# EAGLE design Breadboard (EAGLE 9.4.2)

## Sheet 1 of 2
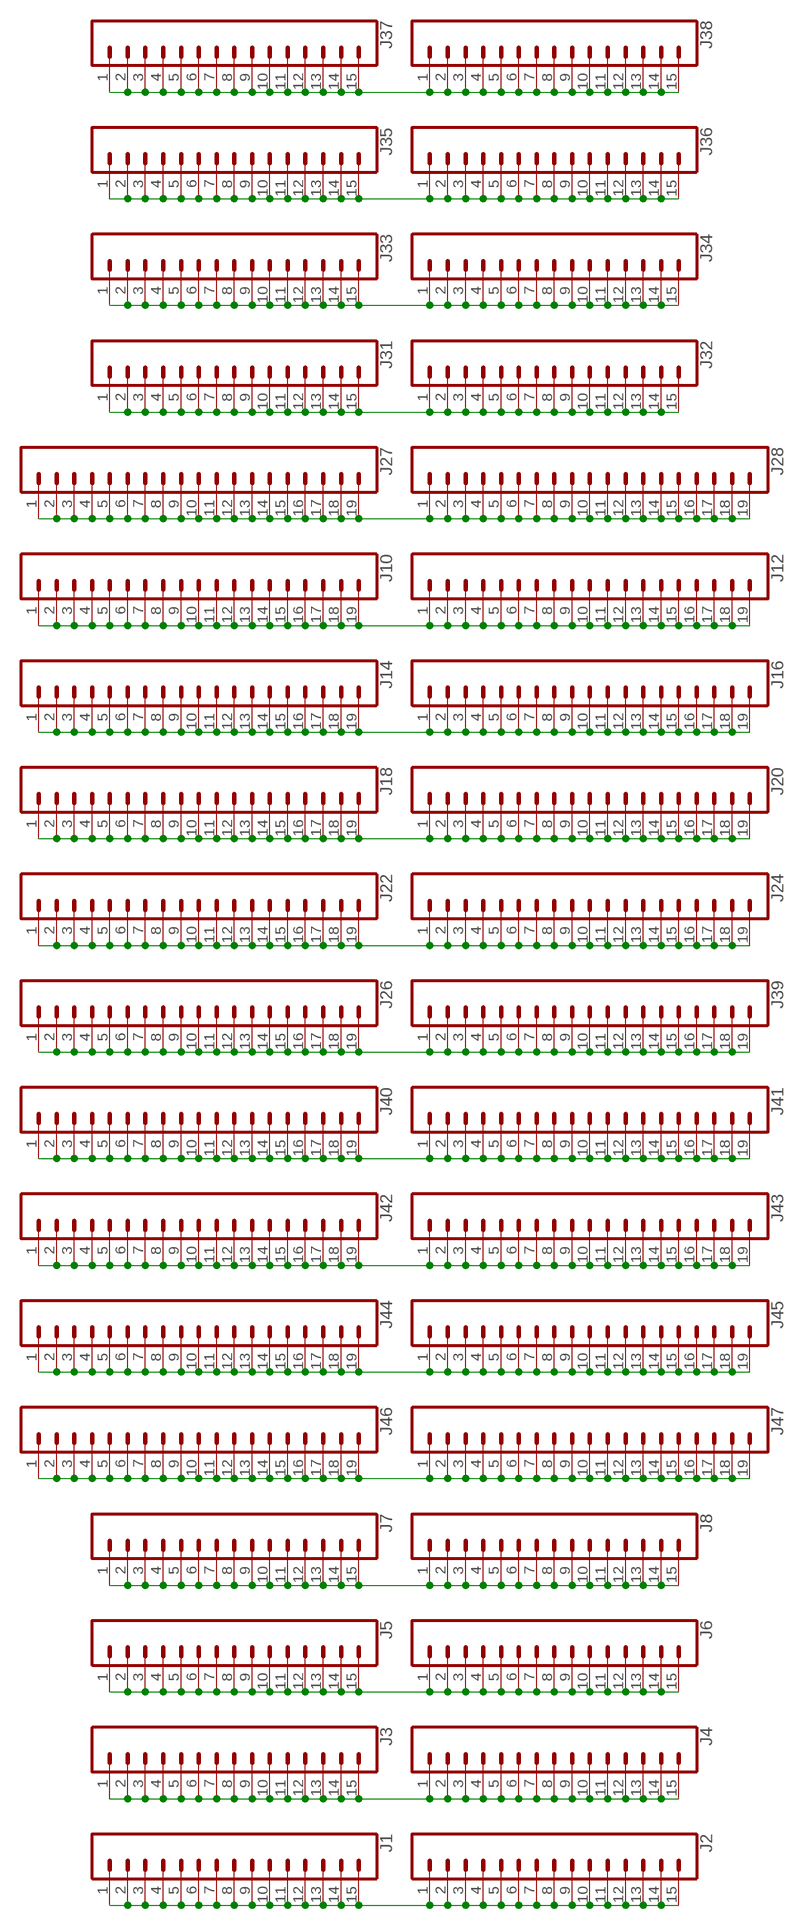
[diagram p0: schematic, sheet 1]

### Parts
J1  CONN_15  [1X15]
J2  CONN_15  [1X15]
J3  CONN_15  [1X15]
J4  CONN_15  [1X15]
J5  CONN_15  [1X15]
J6  CONN_15  [1X15]
J7  CONN_15  [1X15]
J8  CONN_15  [1X15]
J10  CONN_19  [1X19]
J12  CONN_19  [1X19]
J14  CONN_19  [1X19]
J16  CONN_19  [1X19]
J18  CONN_19  [1X19]
J20  CONN_19  [1X19]
J22  CONN_19  [1X19]
J24  CONN_19  [1X19]
J26  CONN_19  [1X19]
J27  CONN_19  [1X19]
J28  CONN_19  [1X19]
J31  CONN_15  [1X15]
J32  CONN_15  [1X15]
J33  CONN_15  [1X15]
J34  CONN_15  [1X15]
J35  CONN_15  [1X15]
J36  CONN_15  [1X15]
J37  CONN_15  [1X15]
J38  CONN_15  [1X15]
J39  CONN_19  [1X19]
J40  CONN_19  [1X19]
J41  CONN_19  [1X19]
J42  CONN_19  [1X19]
J43  CONN_19  [1X19]
J44  CONN_19  [1X19]
J45  CONN_19  [1X19]
J46  CONN_19  [1X19]
J47  CONN_19  [1X19]

### Nets
N$1: J37.1 J37.2 J37.3 J37.4 J37.5 J37.6 J37.7 J37.8 J37.9 J37.10 J37.11 J37.12 J37.13 J37.14 J37.15 J38.1 J38.2 J38.3 J38.4 J38.5 J38.6 J38.7 J38.8 J38.9 J38.10 J38.11 J38.12 J38.13 J38.14 J38.15
N$2: J35.1 J35.2 J35.3 J35.4 J35.5 J35.6 J35.7 J35.8 J35.9 J35.10 J35.11 J35.12 J35.13 J35.14 J35.15 J36.1 J36.2 J36.3 J36.4 J36.5 J36.6 J36.7 J36.8 J36.9 J36.10 J36.11 J36.12 J36.13 J36.14 J36.15
N$3: J33.1 J33.2 J33.3 J33.4 J33.5 J33.6 J33.7 J33.8 J33.9 J33.10 J33.11 J33.12 J33.13 J33.14 J33.15 J34.1 J34.2 J34.3 J34.4 J34.5 J34.6 J34.7 J34.8 J34.9 J34.10 J34.11 J34.12 J34.13 J34.14 J34.15
N$4: J31.1 J31.2 J31.3 J31.4 J31.5 J31.6 J31.7 J31.8 J31.9 J31.10 J31.11 J31.12 J31.13 J31.14 J31.15 J32.1 J32.2 J32.3 J32.4 J32.5 J32.6 J32.7 J32.8 J32.9 J32.10 J32.11 J32.12 J32.13 J32.14 J32.15
N$6: J27.1 J27.2 J27.3 J27.4 J27.5 J27.6 J27.7 J27.8 J27.9 J27.10 J27.11 J27.12 J27.13 J27.14 J27.15 J27.16 J27.17 J27.18 J27.19 J28.1 J28.2 J28.3 J28.4 J28.5 J28.6 J28.7 J28.8 J28.9 J28.10 J28.11 J28.12 J28.13 J28.14 J28.15 J28.16 J28.17 J28.18 J28.19
N$7: J10.1 J10.2 J10.3 J10.4 J10.5 J10.6 J10.7 J10.8 J10.9 J10.10 J10.11 J10.12 J10.13 J10.14 J10.15 J10.16 J10.17 J10.18 J10.19 J12.1 J12.2 J12.3 J12.4 J12.5 J12.6 J12.7 J12.8 J12.9 J12.10 J12.11 J12.12 J12.13 J12.14 J12.15 J12.16 J12.17 J12.18 J12.19
N$8: J14.1 J14.2 J14.3 J14.4 J14.5 J14.6 J14.7 J14.8 J14.9 J14.10 J14.11 J14.12 J14.13 J14.14 J14.15 J14.16 J14.17 J14.18 J14.19 J16.1 J16.2 J16.3 J16.4 J16.5 J16.6 J16.7 J16.8 J16.9 J16.10 J16.11 J16.12 J16.13 J16.14 J16.15 J16.16 J16.17 J16.18 J16.19
N$9: J18.1 J18.2 J18.3 J18.4 J18.5 J18.6 J18.7 J18.8 J18.9 J18.10 J18.11 J18.12 J18.13 J18.14 J18.15 J18.16 J18.17 J18.18 J18.19 J20.1 J20.2 J20.3 J20.4 J20.5 J20.6 J20.7 J20.8 J20.9 J20.10 J20.11 J20.12 J20.13 J20.14 J20.15 J20.16 J20.17 J20.18 J20.19
N$10: J22.1 J22.2 J22.3 J22.4 J22.5 J22.6 J22.7 J22.8 J22.9 J22.10 J22.11 J22.12 J22.13 J22.14 J22.15 J22.16 J22.17 J22.18 J22.19 J24.1 J24.2 J24.3 J24.4 J24.5 J24.6 J24.7 J24.8 J24.9 J24.10 J24.11 J24.12 J24.13 J24.14 J24.15 J24.16 J24.17 J24.18 J24.19
N$11: J26.1 J26.2 J26.3 J26.4 J26.5 J26.6 J26.7 J26.8 J26.9 J26.10 J26.11 J26.12 J26.13 J26.14 J26.15 J26.16 J26.17 J26.18 J26.19 J39.1 J39.2 J39.3 J39.4 J39.5 J39.6 J39.7 J39.8 J39.9 J39.10 J39.11 J39.12 J39.13 J39.14 J39.15 J39.16 J39.17 J39.18 J39.19
N$12: J40.1 J40.2 J40.3 J40.4 J40.5 J40.6 J40.7 J40.8 J40.9 J40.10 J40.11 J40.12 J40.13 J40.14 J40.15 J40.16 J40.17 J40.18 J40.19 J41.1 J41.2 J41.3 J41.4 J41.5 J41.6 J41.7 J41.8 J41.9 J41.10 J41.11 J41.12 J41.13 J41.14 J41.15 J41.16 J41.17 J41.18 J41.19
N$13: J42.1 J42.2 J42.3 J42.4 J42.5 J42.6 J42.7 J42.8 J42.9 J42.10 J42.11 J42.12 J42.13 J42.14 J42.15 J42.16 J42.17 J42.18 J42.19 J43.1 J43.2 J43.3 J43.4 J43.5 J43.6 J43.7 J43.8 J43.9 J43.10 J43.11 J43.12 J43.13 J43.14 J43.15 J43.16 J43.17 J43.18 J43.19
N$14: J44.1 J44.2 J44.3 J44.4 J44.5 J44.6 J44.7 J44.8 J44.9 J44.10 J44.11 J44.12 J44.13 J44.14 J44.15 J44.16 J44.17 J44.18 J44.19 J45.1 J45.2 J45.3 J45.4 J45.5 J45.6 J45.7 J45.8 J45.9 J45.10 J45.11 J45.12 J45.13 J45.14 J45.15 J45.16 J45.17 J45.18 J45.19
N$15: J46.1 J46.2 J46.3 J46.4 J46.5 J46.6 J46.7 J46.8 J46.9 J46.10 J46.11 J46.12 J46.13 J46.14 J46.15 J46.16 J46.17 J46.18 J46.19 J47.1 J47.2 J47.3 J47.4 J47.5 J47.6 J47.7 J47.8 J47.9 J47.10 J47.11 J47.12 J47.13 J47.14 J47.15 J47.16 J47.17 J47.18 J47.19
N$16: J7.1 J7.2 J7.3 J7.4 J7.5 J7.6 J7.7 J7.8 J7.9 J7.10 J7.11 J7.12 J7.13 J7.14 J7.15 J8.1 J8.2 J8.3 J8.4 J8.5 J8.6 J8.7 J8.8 J8.9 J8.10 J8.11 J8.12 J8.13 J8.14 J8.15
N$17: J5.1 J5.2 J5.3 J5.4 J5.5 J5.6 J5.7 J5.8 J5.9 J5.10 J5.11 J5.12 J5.13 J5.14 J5.15 J6.1 J6.2 J6.3 J6.4 J6.5 J6.6 J6.7 J6.8 J6.9 J6.10 J6.11 J6.12 J6.13 J6.14 J6.15
N$18: J3.1 J3.2 J3.3 J3.4 J3.5 J3.6 J3.7 J3.8 J3.9 J3.10 J3.11 J3.12 J3.13 J3.14 J3.15 J4.1 J4.2 J4.3 J4.4 J4.5 J4.6 J4.7 J4.8 J4.9 J4.10 J4.11 J4.12 J4.13 J4.14 J4.15
N$19: J1.1 J1.2 J1.3 J1.4 J1.5 J1.6 J1.7 J1.8 J1.9 J1.10 J1.11 J1.12 J1.13 J1.14 J1.15 J2.1 J2.2 J2.3 J2.4 J2.5 J2.6 J2.7 J2.8 J2.9 J2.10 J2.11 J2.12 J2.13 J2.14 J2.15

## Sheet 2 of 2
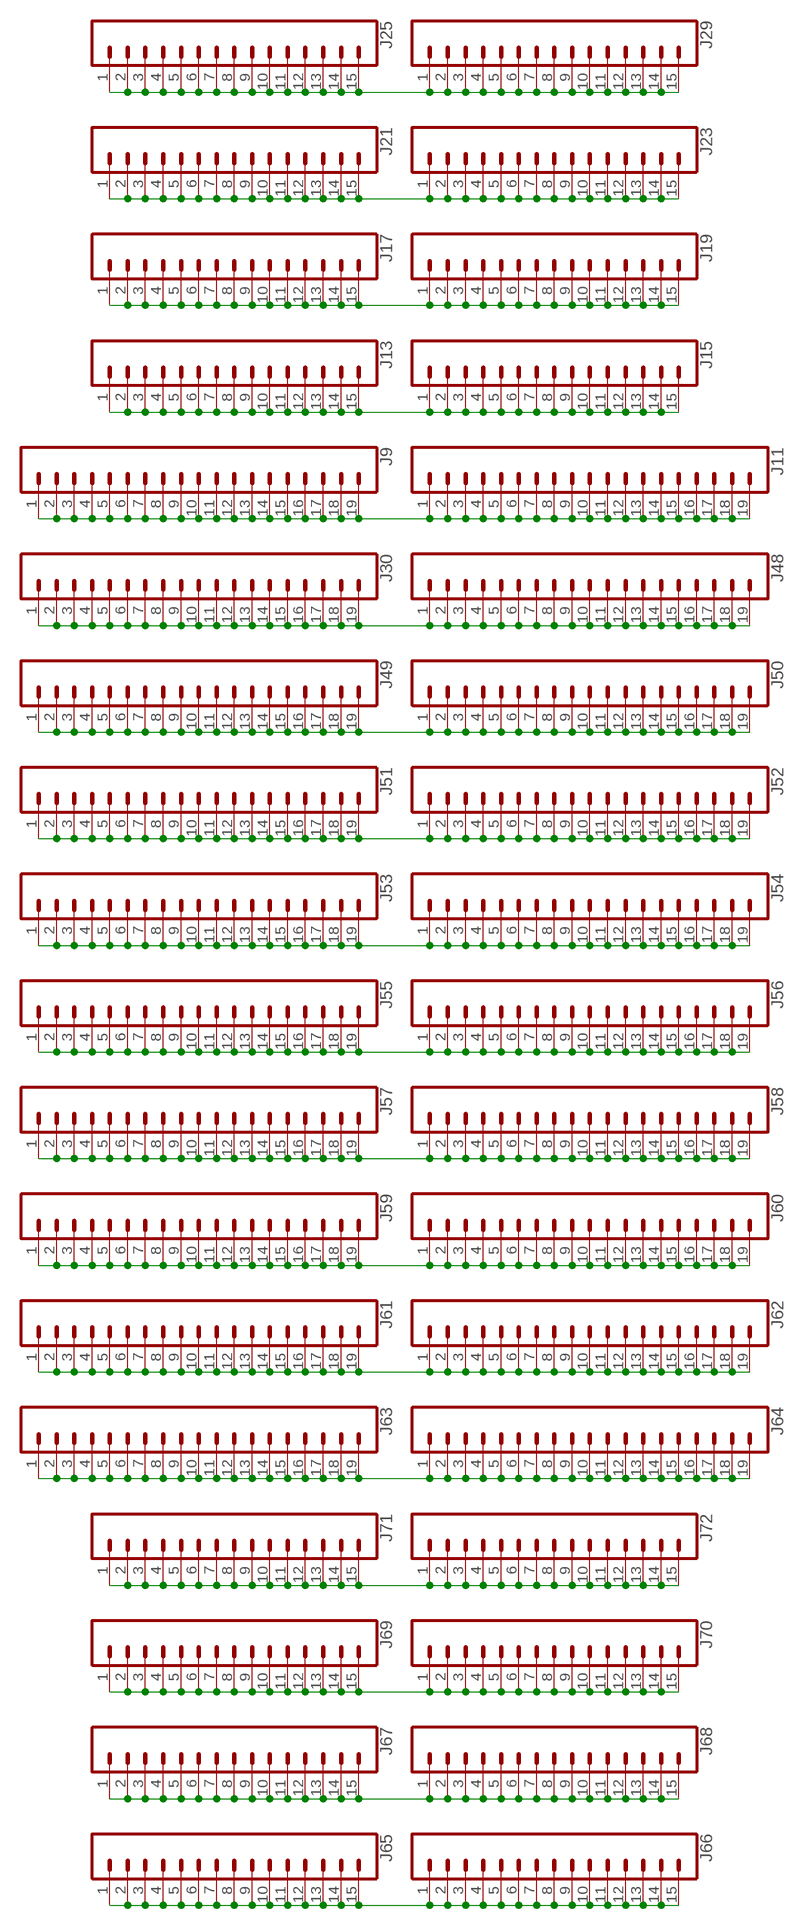
[diagram p1: schematic, sheet 2]

### Parts
J9  CONN_19  [1X19]
J11  CONN_19  [1X19]
J13  CONN_15  [1X15]
J15  CONN_15  [1X15]
J17  CONN_15  [1X15]
J19  CONN_15  [1X15]
J21  CONN_15  [1X15]
J23  CONN_15  [1X15]
J25  CONN_15  [1X15]
J29  CONN_15  [1X15]
J30  CONN_19  [1X19]
J48  CONN_19  [1X19]
J49  CONN_19  [1X19]
J50  CONN_19  [1X19]
J51  CONN_19  [1X19]
J52  CONN_19  [1X19]
J53  CONN_19  [1X19]
J54  CONN_19  [1X19]
J55  CONN_19  [1X19]
J56  CONN_19  [1X19]
J57  CONN_19  [1X19]
J58  CONN_19  [1X19]
J59  CONN_19  [1X19]
J60  CONN_19  [1X19]
J61  CONN_19  [1X19]
J62  CONN_19  [1X19]
J63  CONN_19  [1X19]
J64  CONN_19  [1X19]
J65  CONN_15  [1X15]
J66  CONN_15  [1X15]
J67  CONN_15  [1X15]
J68  CONN_15  [1X15]
J69  CONN_15  [1X15]
J70  CONN_15  [1X15]
J71  CONN_15  [1X15]
J72  CONN_15  [1X15]

### Nets
N$5: J25.1 J25.2 J25.3 J25.4 J25.5 J25.6 J25.7 J25.8 J25.9 J25.10 J25.11 J25.12 J25.13 J25.14 J25.15 J29.1 J29.2 J29.3 J29.4 J29.5 J29.6 J29.7 J29.8 J29.9 J29.10 J29.11 J29.12 J29.13 J29.14 J29.15
N$20: J21.1 J21.2 J21.3 J21.4 J21.5 J21.6 J21.7 J21.8 J21.9 J21.10 J21.11 J21.12 J21.13 J21.14 J21.15 J23.1 J23.2 J23.3 J23.4 J23.5 J23.6 J23.7 J23.8 J23.9 J23.10 J23.11 J23.12 J23.13 J23.14 J23.15
N$21: J17.1 J17.2 J17.3 J17.4 J17.5 J17.6 J17.7 J17.8 J17.9 J17.10 J17.11 J17.12 J17.13 J17.14 J17.15 J19.1 J19.2 J19.3 J19.4 J19.5 J19.6 J19.7 J19.8 J19.9 J19.10 J19.11 J19.12 J19.13 J19.14 J19.15
N$22: J13.1 J13.2 J13.3 J13.4 J13.5 J13.6 J13.7 J13.8 J13.9 J13.10 J13.11 J13.12 J13.13 J13.14 J13.15 J15.1 J15.2 J15.3 J15.4 J15.5 J15.6 J15.7 J15.8 J15.9 J15.10 J15.11 J15.12 J15.13 J15.14 J15.15
N$23: J9.1 J9.2 J9.3 J9.4 J9.5 J9.6 J9.7 J9.8 J9.9 J9.10 J9.11 J9.12 J9.13 J9.14 J9.15 J9.16 J9.17 J9.18 J9.19 J11.1 J11.2 J11.3 J11.4 J11.5 J11.6 J11.7 J11.8 J11.9 J11.10 J11.11 J11.12 J11.13 J11.14 J11.15 J11.16 J11.17 J11.18 J11.19
N$24: J30.1 J30.2 J30.3 J30.4 J30.5 J30.6 J30.7 J30.8 J30.9 J30.10 J30.11 J30.12 J30.13 J30.14 J30.15 J30.16 J30.17 J30.18 J30.19 J48.1 J48.2 J48.3 J48.4 J48.5 J48.6 J48.7 J48.8 J48.9 J48.10 J48.11 J48.12 J48.13 J48.14 J48.15 J48.16 J48.17 J48.18 J48.19
N$25: J49.1 J49.2 J49.3 J49.4 J49.5 J49.6 J49.7 J49.8 J49.9 J49.10 J49.11 J49.12 J49.13 J49.14 J49.15 J49.16 J49.17 J49.18 J49.19 J50.1 J50.2 J50.3 J50.4 J50.5 J50.6 J50.7 J50.8 J50.9 J50.10 J50.11 J50.12 J50.13 J50.14 J50.15 J50.16 J50.17 J50.18 J50.19
N$26: J51.1 J51.2 J51.3 J51.4 J51.5 J51.6 J51.7 J51.8 J51.9 J51.10 J51.11 J51.12 J51.13 J51.14 J51.15 J51.16 J51.17 J51.18 J51.19 J52.1 J52.2 J52.3 J52.4 J52.5 J52.6 J52.7 J52.8 J52.9 J52.10 J52.11 J52.12 J52.13 J52.14 J52.15 J52.16 J52.17 J52.18 J52.19
N$27: J53.1 J53.2 J53.3 J53.4 J53.5 J53.6 J53.7 J53.8 J53.9 J53.10 J53.11 J53.12 J53.13 J53.14 J53.15 J53.16 J53.17 J53.18 J53.19 J54.1 J54.2 J54.3 J54.4 J54.5 J54.6 J54.7 J54.8 J54.9 J54.10 J54.11 J54.12 J54.13 J54.14 J54.15 J54.16 J54.17 J54.18 J54.19
N$28: J55.1 J55.2 J55.3 J55.4 J55.5 J55.6 J55.7 J55.8 J55.9 J55.10 J55.11 J55.12 J55.13 J55.14 J55.15 J55.16 J55.17 J55.18 J55.19 J56.1 J56.2 J56.3 J56.4 J56.5 J56.6 J56.7 J56.8 J56.9 J56.10 J56.11 J56.12 J56.13 J56.14 J56.15 J56.16 J56.17 J56.18 J56.19
N$29: J57.1 J57.2 J57.3 J57.4 J57.5 J57.6 J57.7 J57.8 J57.9 J57.10 J57.11 J57.12 J57.13 J57.14 J57.15 J57.16 J57.17 J57.18 J57.19 J58.1 J58.2 J58.3 J58.4 J58.5 J58.6 J58.7 J58.8 J58.9 J58.10 J58.11 J58.12 J58.13 J58.14 J58.15 J58.16 J58.17 J58.18 J58.19
N$30: J59.1 J59.2 J59.3 J59.4 J59.5 J59.6 J59.7 J59.8 J59.9 J59.10 J59.11 J59.12 J59.13 J59.14 J59.15 J59.16 J59.17 J59.18 J59.19 J60.1 J60.2 J60.3 J60.4 J60.5 J60.6 J60.7 J60.8 J60.9 J60.10 J60.11 J60.12 J60.13 J60.14 J60.15 J60.16 J60.17 J60.18 J60.19
N$31: J61.1 J61.2 J61.3 J61.4 J61.5 J61.6 J61.7 J61.8 J61.9 J61.10 J61.11 J61.12 J61.13 J61.14 J61.15 J61.16 J61.17 J61.18 J61.19 J62.1 J62.2 J62.3 J62.4 J62.5 J62.6 J62.7 J62.8 J62.9 J62.10 J62.11 J62.12 J62.13 J62.14 J62.15 J62.16 J62.17 J62.18 J62.19
N$32: J63.1 J63.2 J63.3 J63.4 J63.5 J63.6 J63.7 J63.8 J63.9 J63.10 J63.11 J63.12 J63.13 J63.14 J63.15 J63.16 J63.17 J63.18 J63.19 J64.1 J64.2 J64.3 J64.4 J64.5 J64.6 J64.7 J64.8 J64.9 J64.10 J64.11 J64.12 J64.13 J64.14 J64.15 J64.16 J64.17 J64.18 J64.19
N$33: J71.1 J71.2 J71.3 J71.4 J71.5 J71.6 J71.7 J71.8 J71.9 J71.10 J71.11 J71.12 J71.13 J71.14 J71.15 J72.1 J72.2 J72.3 J72.4 J72.5 J72.6 J72.7 J72.8 J72.9 J72.10 J72.11 J72.12 J72.13 J72.14 J72.15
N$34: J69.1 J69.2 J69.3 J69.4 J69.5 J69.6 J69.7 J69.8 J69.9 J69.10 J69.11 J69.12 J69.13 J69.14 J69.15 J70.1 J70.2 J70.3 J70.4 J70.5 J70.6 J70.7 J70.8 J70.9 J70.10 J70.11 J70.12 J70.13 J70.14 J70.15
N$35: J67.1 J67.2 J67.3 J67.4 J67.5 J67.6 J67.7 J67.8 J67.9 J67.10 J67.11 J67.12 J67.13 J67.14 J67.15 J68.1 J68.2 J68.3 J68.4 J68.5 J68.6 J68.7 J68.8 J68.9 J68.10 J68.11 J68.12 J68.13 J68.14 J68.15
N$36: J65.1 J65.2 J65.3 J65.4 J65.5 J65.6 J65.7 J65.8 J65.9 J65.10 J65.11 J65.12 J65.13 J65.14 J65.15 J66.1 J66.2 J66.3 J66.4 J66.5 J66.6 J66.7 J66.8 J66.9 J66.10 J66.11 J66.12 J66.13 J66.14 J66.15

## Library data of the parts
J1-J8 J13 J15 J17 J19 J21 J23 J25 J29 J31-J38 J65-J72 = SparkFun-Connectors:CONN_15: Multi connection point. Often used as Generic Header-pin footprint for 0.1 inch spaced/style header connections On any of the 0.1 inch spaced packages, you can populate with these: Break Away Headers - Straight <https://www.sparkfun.com/products/116> (PRT-00116) Break Away Male Headers - Right Angle <https://www.sparkfun.com/products/553> (PRT-00553) Female Headers <https://www.sparkfun.com/products/115> (PRT-00115) Break Away Headers - Machine Pin <https://www.sparkfun.com/products/117> (PRT-00117) Break Away Female Headers - Swiss Machine Pin <https://www.sparkfun.com/products/743> (PRT-00743) For SCREWTERMINALS and SPRING TERMINALS visit here: Screw Terimnals on SparkFun.com <https://www.sparkfun.com/search/results?term=Screw+Terminals> (5mm/3.5mm/2.54mm spacing) This device is also useful as a general connection point to wire up your design to another part of your project. Our various solder wires solder well into these plated through hole pads. Hook-Up Wire - Assortment (Stranded, 22 AWG) <https://www.sparkfun.com/products/11375> (PRT-11375) Hook-Up Wire - Assortment (Solid Core, 22 AWG) <https://www.sparkfun.com/products/11367> (PRT-11367) View the entire wire category on our website here <https://www.sparkfun.com/categories/141> Special notes: Molex polarized connector foot print use with SKU : PRT-08231 with associated crimp pins and housings. 1MM SMD Version SKU: PRT-10208 NOTES ON THE VARIANTS LOCK and LOCK_LONGPADS... This footprint was designed to help hold the alignment of a through-hole component (i.e. 6-pin header) while soldering it into place. You may notice that each hole has been shifted either up or down by 0.005 of an inch from it's more standard position (which is a perfectly straight line). This slight alteration caused the pins (the squares in the middle) to touch the edges of the holes. Because they are alternating, it causes a "brace" to hold the component in place. 0.005 has proven to be the perfect amount of "off-center" position when using our standard breakaway headers. Although looks a little odd when you look at the bare footprint, once you have a header in there, the alteration is very hard to notice. Also,if you push a header all the way into place, it is covered up entirely on the bottom side.
J9-J12 J14 J16 J18 J20 J22 J24 J26-J28 J30 J39-J64 = SparkFun-Connectors:CONN_19: Multi connection point. Often used as Generic Header-pin footprint for 0.1 inch spaced/style header connections On any of the 0.1 inch spaced packages, you can populate with these: Break Away Headers - Straight <https://www.sparkfun.com/products/116> (PRT-00116) Break Away Male Headers - Right Angle <https://www.sparkfun.com/products/553> (PRT-00553) Female Headers <https://www.sparkfun.com/products/115> (PRT-00115) Break Away Headers - Machine Pin <https://www.sparkfun.com/products/117> (PRT-00117) Break Away Female Headers - Swiss Machine Pin <https://www.sparkfun.com/products/743> (PRT-00743) For SCREWTERMINALS and SPRING TERMINALS visit here: Screw Terimnals on SparkFun.com <https://www.sparkfun.com/search/results?term=Screw+Terminals> (5mm/3.5mm/2.54mm spacing) This device is also useful as a general connection point to wire up your design to another part of your project. Our various solder wires solder well into these plated through hole pads. Hook-Up Wire - Assortment (Stranded, 22 AWG) <https://www.sparkfun.com/products/11375> (PRT-11375) Hook-Up Wire - Assortment (Solid Core, 22 AWG) <https://www.sparkfun.com/products/11367> (PRT-11367) View the entire wire category on our website here <https://www.sparkfun.com/categories/141> Special notes: Molex polarized connector foot print use with SKU : PRT-08231 with associated crimp pins and housings. 1MM SMD Version SKU: PRT-10208 NOTES ON THE VARIANTS LOCK and LOCK_LONGPADS... This footprint was designed to help hold the alignment of a through-hole component (i.e. 6-pin header) while soldering it into place. You may notice that each hole has been shifted either up or down by 0.005 of an inch from it's more standard position (which is a perfectly straight line). This slight alteration caused the pins (the squares in the middle) to touch the edges of the holes. Because they are alternating, it causes a "brace" to hold the component in place. 0.005 has proven to be the perfect amount of "off-center" position when using our standard breakaway headers. Although looks a little odd when you look at the bare footprint, once you have a header in there, the alteration is very hard to notice. Also,if you push a header all the way into place, it is covered up entirely on the bottom side.

## Board
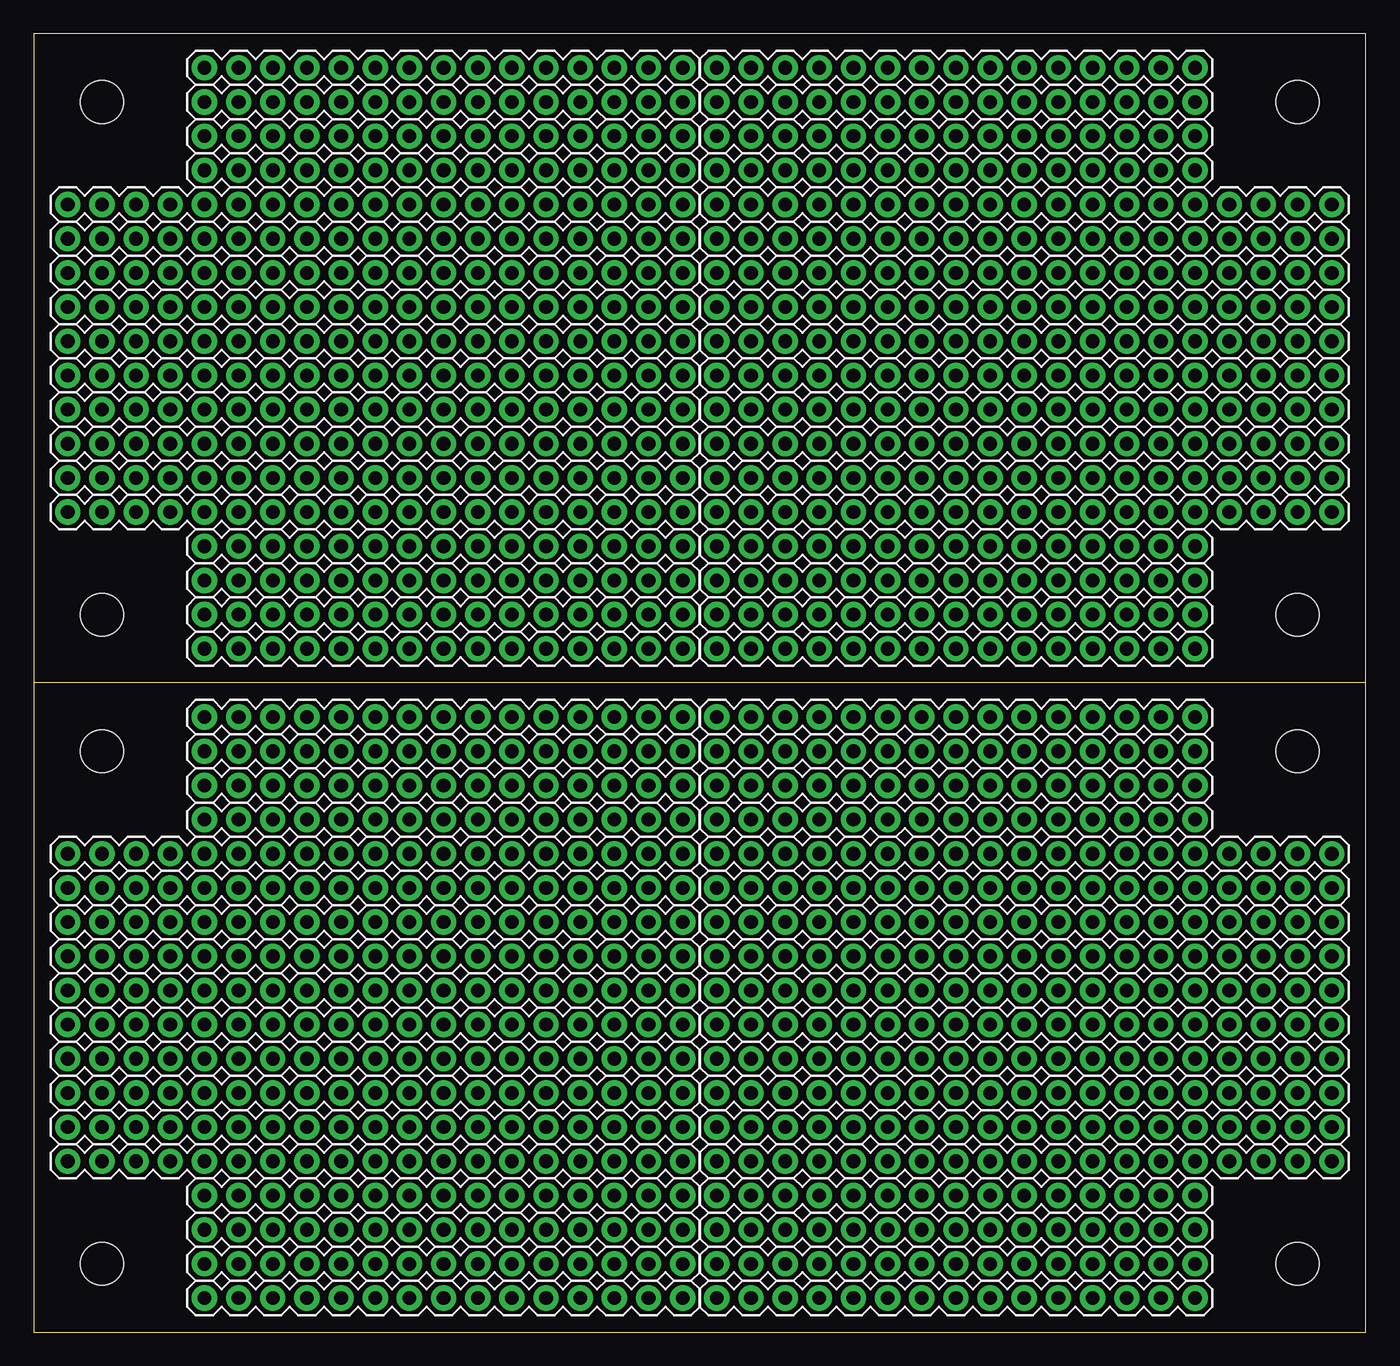
[diagram p2: board, top side]
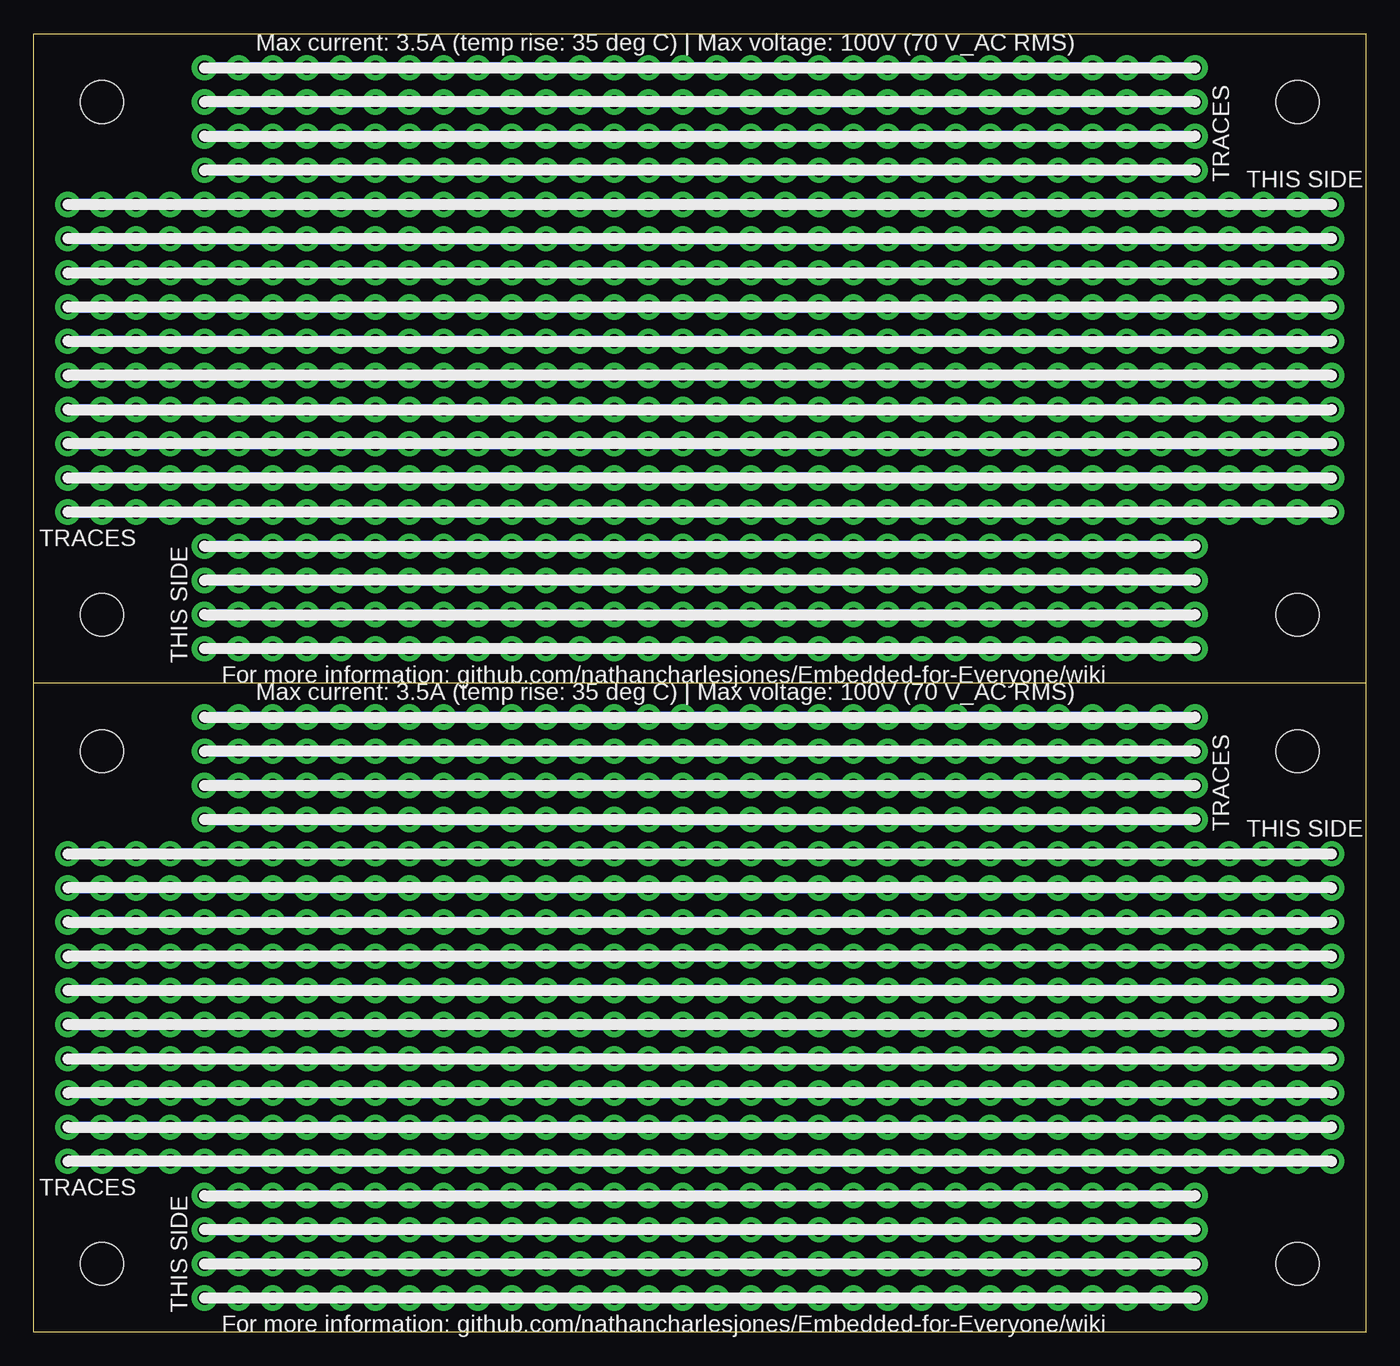
[diagram p3: board, bottom side, seen from below]

Size 99.06 x 96.52 mm. Coordinates in mm from the lower left corner, seen from the top.
Outline: 99.06,48.26 99.06,96.52 0,96.52 0,48.26
Outline: 99.06,48.26 99.06,0 0,0 0,48.26
Outline: 99.06,48.26 0,48.26
Copper layers (1*16): Top 0.035mm / dielectric 1.5mm / Bottom 0.035mm
Design rules "OthermillDRC_1_64_v2": minimum track width 16mil, minimum drill 31mil, track to track 0.39878125mm, track to pad 0.39878125mm, pad to pad 0.39878125mm, via to via 0.39878125mm, smd to smd 0mil, copper to edge 0mil, drill to drill 1mil, minimum pad ring 0mil, minimum via ring 15mil, stop-mask expansion 1mil, vias tented up to drill 30mil, thermal gap 10mil
Holes 3.17 mm at 93.98,91.44 93.98,53.34 5.08,91.44 5.08,53.34 93.98,43.18 93.98,5.08 5.08,43.18 5.08,5.08

### Footprints (pad centres in the part's own frame; a part is rotated, then mirrored left to right if it is on the bottom)
1X15 = drill 1.016 pad 1.88: 1 0,0; 2 2.54,0; 3 5.08,0; 4 7.62,0; 5 10.16,0; 6 12.7,0; 7 15.24,0; 8 17.78,0; 9 20.32,0; 10 22.86,0; 11 25.4,0; 12 27.94,0; 13 30.48,0; 14 33.02,0; 15 35.56,0
1X19 = drill 1.016 pad 1.88: 1 0,0; 2 2.54,0; 3 5.08,0; 4 7.62,0; 5 10.16,0; 6 12.7,0; 7 15.24,0; 8 17.78,0; 9 20.32,0; 10 22.86,0; 11 25.4,0; 12 27.94,0; 13 30.48,0; 14 33.02,0; 15 35.56,0; 16 38.1,0; 17 40.64,0; 18 43.18,0; 19 45.72,0

### Placement (x,y rotation side)
J1  12.7,50.8 0 top
J2  50.8,50.8 0 top
J3  12.7,53.34 0 top
J4  50.8,53.34 0 top
J5  12.7,55.88 0 top
J6  50.8,55.88 0 top
J7  12.7,58.42 0 top
J8  50.8,58.42 0 top
J9  2.54,35.56 0 top
J10  2.54,81.28 0 top
J11  50.8,35.56 0 top
J12  50.8,81.28 0 top
J13  12.7,38.1 0 top
J14  2.54,78.74 0 top
J15  50.8,38.1 0 top
J16  50.8,78.74 0 top
J17  12.7,40.64 0 top
J18  2.54,76.2 0 top
J19  50.8,40.64 0 top
J20  50.8,76.2 0 top
J21  12.7,43.18 0 top
J22  2.54,73.66 0 top
J23  50.8,43.18 0 top
J24  50.8,73.66 0 top
J25  12.7,45.72 0 top
J26  2.54,71.12 0 top
J27  2.54,83.82 0 top
J28  50.8,83.82 0 top
J29  50.8,45.72 0 top
J30  2.54,33.02 0 top
J31  12.7,86.36 0 top
J32  50.8,86.36 0 top
J33  12.7,88.9 0 top
J34  50.8,88.9 0 top
J35  12.7,91.44 0 top
J36  50.8,91.44 0 top
J37  12.7,93.98 0 top
J38  50.8,93.98 0 top
J39  50.8,71.12 0 top
J40  2.54,68.58 0 top
J41  50.8,68.58 0 top
J42  2.54,66.04 0 top
J43  50.8,66.04 0 top
J44  2.54,63.5 0 top
J45  50.8,63.5 0 top
J46  2.54,60.96 0 top
J47  50.8,60.96 0 top
J48  50.8,33.02 0 top
J49  2.54,30.48 0 top
J50  50.8,30.48 0 top
J51  2.54,27.94 0 top
J52  50.8,27.94 0 top
J53  2.54,25.4 0 top
J54  50.8,25.4 0 top
J55  2.54,22.86 0 top
J56  50.8,22.86 0 top
J57  2.54,20.32 0 top
J58  50.8,20.32 0 top
J59  2.54,17.78 0 top
J60  50.8,17.78 0 top
J61  2.54,15.24 0 top
J62  50.8,15.24 0 top
J63  2.54,12.7 0 top
J64  50.8,12.7 0 top
J65  12.7,2.54 0 top
J66  50.8,2.54 0 top
J67  12.7,5.08 0 top
J68  50.8,5.08 0 top
J69  12.7,7.62 0 top
J70  50.8,7.62 0 top
J71  12.7,10.16 0 top
J72  50.8,10.16 0 top

### Tracks (layer width: path | path; a pad name or v marks a point on that pad's centre or on a via)
N$1
  Bottom 0.813: J37.1 J37.2 J37.3 J37.4 J37.5 J37.6 J37.7 J37.8 J37.9 J37.10 J37.11 J37.12 J37.13 J37.14 J37.15 J38.1 J38.2 J38.3 J38.4 J38.5 J38.6 J38.7 J38.8 J38.9 J38.10 J38.11 J38.12 J38.13 J38.14 J38.15
N$2
  Bottom 0.813: J36.15 J36.14 J36.13 J36.12 J36.11 J36.10 J36.9 J36.8 J36.7 J36.6 J36.5 J36.4 J36.3 J36.2 J36.1 J35.15 J35.14 J35.13 J35.12 J35.11 J35.10 J35.9 J35.8 J35.7 J35.6 J35.5 J35.4 J35.3 J35.2 J35.1
N$3
  Bottom 0.813: J33.1 J33.2 J33.3 J33.4 J33.5 J33.6 J33.7 J33.8 J33.9 J33.10 J33.11 J33.12 J33.13 J33.14 J33.15 J34.1 J34.2 J34.3 J34.4 J34.5 J34.6 J34.7 J34.8 J34.9 J34.10 J34.11 J34.12 J34.13 J34.14 J34.15
N$4
  Bottom 0.813: J32.15 J32.14 J32.13 J32.12 J32.11 J32.10 J32.9 J32.8 J32.7 J32.6 J32.5 J32.4 J32.3 J32.2 J32.1 J31.15 J31.14 J31.13 J31.12 J31.11 J31.10 J31.9 J31.8 J31.7 J31.6 J31.5 J31.4 J31.3 J31.2 J31.1
N$5
  Bottom 0.813: J25.1 J25.2 J25.3 J25.4 J25.5 J25.6 J25.7 J25.8 J25.9 J25.10 J25.11 J25.12 J25.13 J25.14 J25.15 J29.1 J29.2 J29.3 J29.4 J29.5 J29.6 J29.7 J29.8 J29.9 J29.10 J29.11 J29.12 J29.13 J29.14 J29.15
N$6
  Bottom 0.813: J27.1 J27.2 J27.3 J27.4 J27.5 J27.6 J27.7 J27.8 J27.9 J27.10 J27.11 J27.12 J27.13 J27.14 J27.15 J27.16 J27.17 J27.18 J27.19 J28.1 J28.2 J28.3 J28.4 J28.5 J28.6 J28.7 J28.8 J28.9 J28.10 J28.11 J28.12 J28.13 J28.14 J28.15 J28.16 J28.17 J28.18 J28.19
N$7
  Bottom 0.813: J12.19 J12.18 J12.17 J12.16 J12.15 J12.14 J12.13 J12.12 J12.11 J12.10 J12.9 J12.8 J12.7 J12.6 J12.5 J12.4 J12.3 J12.2 J12.1 J10.19 J10.18 J10.17 J10.16 J10.15 J10.14 J10.13 J10.12 J10.11 J10.10 J10.9 J10.8 J10.7 J10.6 J10.5 J10.4 J10.3 J10.2 J10.1
N$8
  Bottom 0.813: J14.1 J14.2 J14.3 J14.4 J14.5 J14.6 J14.7 J14.8 J14.9 J14.10 J14.11 J14.12 J14.13 J14.14 J14.15 J14.16 J14.17 J14.18 J14.19 J16.1 J16.2 J16.3 J16.4 J16.5 J16.6 J16.7 J16.8 J16.9 J16.10 J16.11 J16.12 J16.13 J16.14 J16.15 J16.16 J16.17 J16.18 J16.19
N$9
  Bottom 0.813: J20.19 J20.18 J20.17 J20.16 J20.15 J20.14 J20.13 J20.12 J20.11 J20.10 J20.9 J20.8 J20.7 J20.6 J20.5 J20.4 J20.3 J20.2 J20.1 J18.19 J18.18 J18.17 J18.16 J18.15 J18.14 J18.13 J18.12 J18.11 J18.10 J18.9 J18.8 J18.7 J18.6 J18.5 J18.4 J18.3 J18.2 J18.1
N$10
  Bottom 0.813: J22.1 J22.2 J22.3 J22.4 J22.5 J22.6 J22.7 J22.8 J22.9 J22.10 J22.11 J22.12 J22.13 J22.14 J22.15 J22.16 J22.17 J22.18 J22.19 J24.1 J24.2 J24.3 J24.4 J24.5 J24.6 J24.7 J24.8 J24.9 J24.10 J24.11 J24.12 J24.13 J24.14 J24.15 J24.16 J24.17 J24.18 J24.19
N$11
  Bottom 0.813: J39.19 J39.18 J39.17 J39.16 J39.15 J39.14 J39.13 J39.12 J39.11 J39.10 J39.9 J39.8 J39.7 J39.6 J39.5 J39.4 J39.3 J39.2 J39.1 J26.19 J26.18 J26.17 J26.16 J26.15 J26.14 J26.13 J26.12 J26.11 J26.10 J26.9 J26.8 J26.7 J26.6 J26.5 J26.4 J26.3 J26.2 J26.1
N$12
  Bottom 0.813: J40.1 J40.2 J40.3 J40.4 J40.5 J40.6 J40.7 J40.8 J40.9 J40.10 J40.11 J40.12 J40.13 J40.14 J40.15 J40.16 J40.17 J40.18 J40.19 J41.1 J41.2 J41.3 J41.4 J41.5 J41.6 J41.7 J41.8 J41.9 J41.10 J41.11 J41.12 J41.13 J41.14 J41.15 J41.16 J41.17 J41.18 J41.19
N$13
  Bottom 0.813: J43.19 J43.18 J43.17 J43.16 J43.15 J43.14 J43.13 J43.12 J43.11 J43.10 J43.9 J43.8 J43.7 J43.6 J43.5 J43.4 J43.3 J43.2 J43.1 J42.19 J42.18 J42.17 J42.16 J42.15 J42.14 J42.13 J42.12 J42.11 J42.10 J42.9 J42.8 J42.7 J42.6 J42.5 J42.4 J42.3 J42.2 J42.1
N$14
  Bottom 0.813: J44.1 J44.2 J44.3 J44.4 J44.5 J44.6 J44.7 J44.8 J44.9 J44.10 J44.11 J44.12 J44.13 J44.14 J44.15 J44.16 J44.17 J44.18 J44.19 J45.1 J45.2 J45.3 J45.4 J45.5 J45.6 J45.7 J45.8 J45.9 J45.10 J45.11 J45.12 J45.13 J45.14 J45.15 J45.16 J45.17 J45.18 J45.19
N$15
  Bottom 0.813: J47.19 J47.18 J47.17 J47.16 J47.15 J47.14 J47.13 J47.12 J47.11 J47.10 J47.9 J47.8 J47.7 J47.6 J47.5 J47.4 J47.3 J47.2 J47.1 J46.19 J46.18 J46.17 J46.16 J46.15 J46.14 J46.13 J46.12 J46.11 J46.10 J46.9 J46.8 J46.7 J46.6 J46.5 J46.4 J46.3 J46.2 J46.1
N$16
  Bottom 0.813: J7.1 J7.2 J7.3 J7.4 J7.5 J7.6 J7.7 J7.8 J7.9 J7.10 J7.11 J7.12 J7.13 J7.14 J7.15 J8.1 J8.2 J8.3 J8.4 J8.5 J8.6 J8.7 J8.8 J8.9 J8.10 J8.11 J8.12 J8.13 J8.14 J8.15
N$17
  Bottom 0.813: J6.15 J6.14 J6.13 J6.12 J6.11 J6.10 J6.9 J6.8 J6.7 J6.6 J6.5 J6.4 J6.3 J6.2 J6.1 J5.15 J5.14 J5.13 J5.12 J5.11 J5.10 J5.9 J5.8 J5.7 J5.6 J5.5 J5.4 J5.3 J5.2 J5.1
N$18
  Bottom 0.813: J3.1 J3.2 J3.3 J3.4 J3.5 J3.6 J3.7 J3.8 J3.9 J3.10 J3.11 J3.12 J3.13 J3.14 J3.15 J4.1 J4.2 J4.3 J4.4 J4.5 J4.6 J4.7 J4.8 J4.9 J4.10 J4.11 J4.12 J4.13 J4.14 J4.15
N$19
  Bottom 0.813: J1.1 J1.2 J1.3 J1.4 J1.5 J1.6 J1.7 J1.8 J1.9 J1.10 J1.11 J1.12 J1.13 J1.14 J1.15 J2.1 J2.2 J2.3 J2.4 J2.5 J2.6 J2.7 J2.8 J2.9 J2.10 J2.11 J2.12 J2.13 J2.14 J2.15
N$20
  Bottom 0.813: J23.15 J23.14 J23.13 J23.12 J23.11 J23.10 J23.9 J23.8 J23.7 J23.6 J23.5 J23.4 J23.3 J23.2 J23.1 J21.15 J21.14 J21.13 J21.12 J21.11 J21.10 J21.9 J21.8 J21.7 J21.6 J21.5 J21.4 J21.3 J21.2 J21.1
N$21
  Bottom 0.813: J17.1 J17.2 J17.3 J17.4 J17.5 J17.6 J17.7 J17.8 J17.9 J17.10 J17.11 J17.12 J17.13 J17.14 J17.15 J19.1 J19.2 J19.3 J19.4 J19.5 J19.6 J19.7 J19.8 J19.9 J19.10 J19.11 J19.12 J19.13 J19.14 J19.15
N$22
  Bottom 0.813: J15.15 J15.14 J15.13 J15.12 J15.11 J15.10 J15.9 J15.8 J15.7 J15.6 J15.5 J15.4 J15.3 J15.2 J15.1 J13.15 J13.14 J13.13 J13.12 J13.11 J13.10 J13.9 J13.8 J13.7 J13.6 J13.5 J13.4 J13.3 J13.2 J13.1
N$23
  Bottom 0.813: J9.1 J9.2 J9.3 J9.4 J9.5 J9.6 J9.7 J9.8 J9.9 J9.10 J9.11 J9.12 J9.13 J9.14 J9.15 J9.16 J9.17 J9.18 J9.19 J11.1 J11.2 J11.3 J11.4 J11.5 J11.6 J11.7 J11.8 J11.9 J11.10 J11.11 J11.12 J11.13 J11.14 J11.15 J11.16 J11.17 J11.18 J11.19
N$24
  Bottom 0.813: J48.19 J48.18 J48.17 J48.16 J48.15 J48.14 J48.13 J48.12 J48.11 J48.10 J48.9 J48.8 J48.7 J48.6 J48.5 J48.4 J48.3 J48.2 J48.1 J30.19 J30.18 J30.17 J30.16 J30.15 J30.14 J30.13 J30.12 J30.11 J30.10 J30.9 J30.8 J30.7 J30.6 J30.5 J30.4 J30.3 J30.2 J30.1
N$25
  Bottom 0.813: J49.1 J49.2 J49.3 J49.4 J49.5 J49.6 J49.7 J49.8 J49.9 J49.10 J49.11 J49.12 J49.13 J49.14 J49.15 J49.16 J49.17 J49.18 J49.19 J50.1 J50.2 J50.3 J50.4 J50.5 J50.6 J50.7 J50.8 J50.9 J50.10 J50.11 J50.12 J50.13 J50.14 J50.15 J50.16 J50.17 J50.18 J50.19
N$26
  Bottom 0.813: J52.19 J52.18 J52.17 J52.16 J52.15 J52.14 J52.13 J52.12 J52.11 J52.10 J52.9 J52.8 J52.7 J52.6 J52.5 J52.4 J52.3 J52.2 J52.1 J51.19 J51.18 J51.17 J51.16 J51.15 J51.14 J51.13 J51.12 J51.11 J51.10 J51.9 J51.8 J51.7 J51.6 J51.5 J51.4 J51.3 J51.2 J51.1
N$27
  Bottom 0.813: J53.1 J53.2 J53.3 J53.4 J53.5 J53.6 J53.7 J53.8 J53.9 J53.10 J53.11 J53.12 J53.13 J53.14 J53.15 J53.16 J53.17 J53.18 J53.19 J54.1 J54.2 J54.3 J54.4 J54.5 J54.6 J54.7 J54.8 J54.9 J54.10 J54.11 J54.12 J54.13 J54.14 J54.15 J54.16 J54.17 J54.18 J54.19
N$28
  Bottom 0.813: J56.19 J56.18 J56.17 J56.16 J56.15 J56.14 J56.13 J56.12 J56.11 J56.10 J56.9 J56.8 J56.7 J56.6 J56.5 J56.4 J56.3 J56.2 J56.1 J55.19 J55.18 J55.17 J55.16 J55.15 J55.14 J55.13 J55.12 J55.11 J55.10 J55.9 J55.8 J55.7 J55.6 J55.5 J55.4 J55.3 J55.2 J55.1
N$29
  Bottom 0.813: J57.1 J57.2 J57.3 J57.4 J57.5 J57.6 J57.7 J57.8 J57.9 J57.10 J57.11 J57.12 J57.13 J57.14 J57.15 J57.16 J57.17 J57.18 J57.19 J58.1 J58.2 J58.3 J58.4 J58.5 J58.6 J58.7 J58.8 J58.9 J58.10 J58.11 J58.12 J58.13 J58.14 J58.15 J58.16 J58.17 J58.18 J58.19
N$30
  Bottom 0.813: J60.19 J60.18 J60.17 J60.16 J60.15 J60.14 J60.13 J60.12 J60.11 J60.10 J60.9 J60.8 J60.7 J60.6 J60.5 J60.4 J60.3 J60.2 J60.1 J59.19 J59.18 J59.17 J59.16 J59.15 J59.14 J59.13 J59.12 J59.11 J59.10 J59.9 J59.8 J59.7 J59.6 J59.5 J59.4 J59.3 J59.2 J59.1
N$31
  Bottom 0.813: J61.1 J61.2 J61.3 J61.4 J61.5 J61.6 J61.7 J61.8 J61.9 J61.10 J61.11 J61.12 J61.13 J61.14 J61.15 J61.16 J61.17 J61.18 J61.19 J62.1 J62.2 J62.3 J62.4 J62.5 J62.6 J62.7 J62.8 J62.9 J62.10 J62.11 J62.12 J62.13 J62.14 J62.15 J62.16 J62.17 J62.18 J62.19
N$32
  Bottom 0.813: J64.19 J64.18 J64.17 J64.16 J64.15 J64.14 J64.13 J64.12 J64.11 J64.10 J64.9 J64.8 J64.7 J64.6 J64.5 J64.4 J64.3 J64.2 J64.1 J63.19 J63.18 J63.17 J63.16 J63.15 J63.14 J63.13 J63.12 J63.11 J63.10 J63.9 J63.8 J63.7 J63.6 J63.5 J63.4 J63.3 J63.2 J63.1
N$33
  Bottom 0.813: J71.1 J71.2 J71.3 J71.4 J71.5 J71.6 J71.7 J71.8 J71.9 J71.10 J71.11 J71.12 J71.13 J71.14 J71.15 J72.1 J72.2 J72.3 J72.4 J72.5 J72.6 J72.7 J72.8 J72.9 J72.10 J72.11 J72.12 J72.13 J72.14 J72.15
N$34
  Bottom 0.813: J70.15 J70.14 J70.13 J70.12 J70.11 J70.10 J70.9 J70.8 J70.7 J70.6 J70.5 J70.4 J70.3 J70.2 J70.1 J69.15 J69.14 J69.13 J69.12 J69.11 J69.10 J69.9 J69.8 J69.7 J69.6 J69.5 J69.4 J69.3 J69.2 J69.1
N$35
  Bottom 0.813: J67.1 J67.2 J67.3 J67.4 J67.5 J67.6 J67.7 J67.8 J67.9 J67.10 J67.11 J67.12 J67.13 J67.14 J67.15 J68.1 J68.2 J68.3 J68.4 J68.5 J68.6 J68.7 J68.8 J68.9 J68.10 J68.11 J68.12 J68.13 J68.14 J68.15
N$36
  Bottom 0.813: J65.1 J65.2 J65.3 J65.4 J65.5 J65.6 J65.7 J65.8 J65.9 J65.10 J65.11 J65.12 J65.13 J65.14 J65.15 J66.1 J66.2 J66.3 J66.4 J66.5 J66.6 J66.7 J66.8 J66.9 J66.10 J66.11 J66.12 J66.13 J66.14 J66.15

### Text on the board
bNames: Max current: 3.5A (temp rise: 35 deg C) | Max voltage: 100V (70 V_AC RMS) | TRACES | THIS SIDE | TRACES | THIS SIDE | For more information: github.com/nathancharlesjones/Embedded-for-Everyone/wiki | Max current: 3.5A (temp rise: 35 deg C) | Max voltage: 100V (70 V_AC RMS) | TRACES | THIS SIDE | TRACES | THIS SIDE | For more information: github.com/nathancharlesjones/Embedded-for-Everyone/wiki